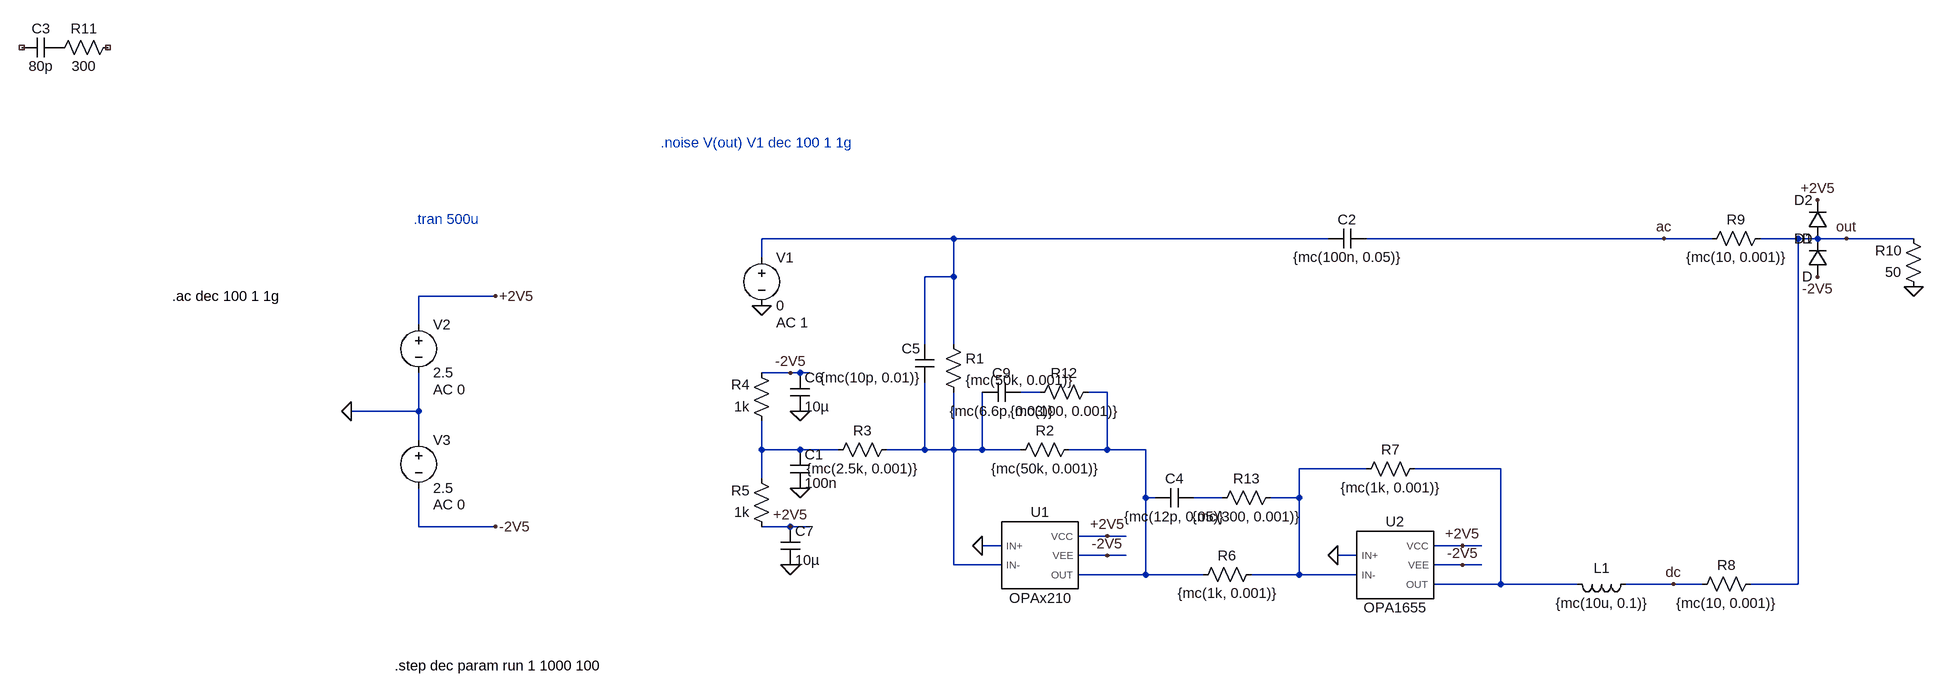
[diagram p0: schematic Draft2.asc]
Draft2.asc, the LTspice schematic file:
Version 4.1
SHEET 1 1824 844
WIRE -304 -48 -624 -48
WIRE 320 -48 -304 -48
WIRE 880 -48 384 -48
WIRE 960 -48 880 -48
WIRE 1104 -48 1040 -48
WIRE 1136 -48 1104 -48
WIRE 1184 -48 1136 -48
WIRE 1296 -48 1184 -48
WIRE -624 -16 -624 -48
WIRE -304 16 -304 -48
WIRE -304 16 -352 16
WIRE -1136 48 -1264 48
WIRE -1264 96 -1264 48
WIRE -352 128 -352 16
WIRE -304 128 -304 16
WIRE -576 176 -624 176
WIRE -560 176 -576 176
WIRE -544 176 -560 176
WIRE -160 208 -192 208
WIRE -48 208 -80 208
WIRE -1264 240 -1264 176
WIRE -1264 240 -1376 240
WIRE -1264 288 -1264 240
WIRE -624 304 -624 256
WIRE -560 304 -624 304
WIRE -496 304 -560 304
WIRE -352 304 -352 192
WIRE -352 304 -416 304
WIRE -304 304 -304 208
WIRE -304 304 -352 304
WIRE -256 304 -256 208
WIRE -256 304 -304 304
WIRE -192 304 -256 304
WIRE -48 304 -48 208
WIRE -48 304 -112 304
WIRE 16 304 -48 304
WIRE 384 336 272 336
WIRE 608 336 464 336
WIRE -624 352 -624 304
WIRE 16 384 16 304
WIRE 32 384 16 384
WIRE 144 384 96 384
WIRE 272 384 272 336
WIRE 272 384 224 384
WIRE -1264 432 -1264 368
WIRE -1136 432 -1264 432
WIRE -576 432 -624 432
WIRE -544 432 -576 432
WIRE -48 448 -96 448
WIRE -16 448 -48 448
WIRE -224 464 -256 464
WIRE 544 464 496 464
WIRE 576 464 544 464
WIRE -48 480 -96 480
WIRE -16 480 -48 480
WIRE 368 480 336 480
WIRE -304 496 -304 304
WIRE -224 496 -304 496
WIRE 544 496 496 496
WIRE 576 496 544 496
WIRE 16 512 16 384
WIRE 16 512 -96 512
WIRE 112 512 16 512
WIRE 272 512 272 384
WIRE 272 512 192 512
WIRE 368 512 272 512
WIRE 608 528 608 336
WIRE 608 528 496 528
WIRE 736 528 608 528
WIRE 896 528 816 528
WIRE 944 528 896 528
WIRE 1104 528 1104 -48
WIRE 1104 528 1024 528
FLAG -624 64 0
FLAG -576 176 -2V5
FLAG -560 368 0
FLAG -576 432 +2V5
FLAG -48 480 -2V5
FLAG -48 448 +2V5
FLAG 336 480 0
FLAG 544 496 -2V5
FLAG 544 464 +2V5
FLAG 1296 32 0
FLAG -1376 240 0
FLAG -1136 48 +2V5
FLAG -1136 432 -2V5
FLAG 1184 -48 out
FLAG 880 -48 ac
FLAG 896 528 dc
FLAG -256 464 0
FLAG 1136 16 -2V5
FLAG 1136 -112 +2V5
FLAG -560 240 0
FLAG -576 496 0
SYMBOL res -320 112 R0
SYMATTR InstName R1
SYMATTR Value {mc(50k, 0.001)}
SYMBOL res -96 288 R90
WINDOW 0 0 56 VBottom 2
WINDOW 3 32 56 VTop 2
SYMATTR InstName R2
SYMATTR Value {mc(50k, 0.001)}
SYMBOL res -400 288 R90
WINDOW 0 0 56 VBottom 2
WINDOW 3 32 56 VTop 2
SYMATTR InstName R3
SYMATTR Value {mc(2.5k, 0.001)}
SYMBOL res -608 272 R180
WINDOW 0 36 76 Left 2
WINDOW 3 36 40 Left 2
SYMATTR InstName R4
SYMATTR Value 1k
SYMBOL res -608 448 R180
WINDOW 0 36 76 Left 2
WINDOW 3 36 40 Left 2
SYMATTR InstName R5
SYMATTR Value 1k
SYMBOL voltage -624 -32 R0
WINDOW 123 24 124 Left 2
WINDOW 39 0 0 Left 0
SYMATTR InstName V1
SYMATTR Value 0
SYMATTR Value2 AC 1
SYMBOL cap -576 304 R0
SYMATTR InstName C1
SYMATTR Value 100n
SYMBOL cap 384 -64 R90
WINDOW 0 0 32 VBottom 2
WINDOW 3 32 32 VTop 2
SYMATTR InstName C2
SYMATTR Value {mc(100n, 0.05)}
SYMATTR SpiceLine Rser=10m Lser=2n
SYMBOL OPAx210 -160 480 R0
SYMATTR InstName U1
SYMBOL res 208 496 R90
WINDOW 0 0 56 VBottom 2
WINDOW 3 32 56 VTop 2
SYMATTR InstName R6
SYMATTR Value {mc(1k, 0.001)}
SYMBOL res 480 320 R90
WINDOW 0 0 56 VBottom 2
WINDOW 3 32 56 VTop 2
SYMATTR InstName R7
SYMATTR Value {mc(1k, 0.001)}
SYMBOL OPA1655 432 496 R0
SYMATTR InstName U2
SYMBOL ind 832 512 R90
WINDOW 0 5 56 VBottom 2
WINDOW 3 32 56 VTop 2
SYMATTR InstName L1
SYMATTR Value {mc(10u, 0.1)}
SYMATTR SpiceLine Ipk=0.74 Rser=0.056 Rpar=0 Cpar=0
SYMBOL res 1040 512 R90
WINDOW 0 0 56 VBottom 2
WINDOW 3 32 56 VTop 2
SYMATTR InstName R8
SYMATTR Value {mc(10, 0.001)}
SYMBOL res 1056 -64 R90
WINDOW 0 0 56 VBottom 2
WINDOW 3 32 56 VTop 2
SYMATTR InstName R9
SYMATTR Value {mc(10, 0.001)}
SYMBOL res 1312 48 R180
WINDOW 0 36 76 Left 2
WINDOW 3 36 40 Left 2
SYMATTR InstName R10
SYMATTR Value 50
SYMBOL voltage -1264 80 R0
WINDOW 123 24 124 Left 2
WINDOW 39 0 0 Left 0
SYMATTR InstName V2
SYMATTR Value 2.5
SYMATTR Value2 AC 0
SYMBOL voltage -1264 272 R0
WINDOW 123 24 124 Left 2
WINDOW 39 0 0 Left 0
SYMATTR InstName V3
SYMATTR Value 2.5
SYMATTR Value2 AC 0
SYMBOL cap -9920 -1184 R90
WINDOW 0 0 32 VBottom 2
WINDOW 3 32 32 VTop 2
SYMATTR InstName C3
SYMATTR Value 80p
SYMBOL res -9824 -1184 R90
WINDOW 0 0 56 VBottom 2
WINDOW 3 32 56 VTop 2
SYMATTR InstName R11
SYMATTR Value 300
SYMBOL diode 1152 16 R180
WINDOW 0 24 64 Left 2
WINDOW 3 24 0 Left 2
SYMATTR InstName D1
SYMBOL diode 1152 -48 R180
WINDOW 0 24 64 Left 2
WINDOW 3 24 0 Left 2
SYMATTR InstName D2
SYMBOL cap -576 176 R0
SYMATTR InstName C6
SYMATTR Value 10µ
SYMBOL cap -592 432 R0
SYMATTR InstName C7
SYMATTR Value 10µ
SYMBOL cap 96 368 R90
WINDOW 0 0 32 VBottom 2
WINDOW 3 32 32 VTop 2
SYMATTR InstName C4
SYMATTR Value {mc(12p, 0.05)}
SYMATTR SpiceLine V=200 Irms=957.257m Rser=0.163695 Lser=409.656p
SYMBOL cap -336 192 R180
WINDOW 0 24 56 Left 2
WINDOW 3 24 8 Left 2
SYMATTR InstName C5
SYMATTR Value {mc(10p, 0.01)}
SYMATTR SpiceLine V=50 Irms=0 Rser=0.5317 Lser=450p
SYMBOL cap -256 224 R270
WINDOW 0 32 32 VTop 2
WINDOW 3 0 32 VBottom 2
SYMATTR InstName C9
SYMATTR Value {mc(6.6p, 0.03)}
SYMATTR SpiceLine V=1.5K Irms=813.688m Rser=0.728 Lser=862.574p
SYMBOL res 240 368 R90
WINDOW 0 0 56 VBottom 2
WINDOW 3 32 56 VTop 2
SYMATTR InstName R13
SYMATTR Value {mc(300, 0.001)}
SYMATTR SpiceLine tol=1 pwr=0.1
SYMBOL res -64 192 R90
WINDOW 0 0 56 VBottom 2
WINDOW 3 32 56 VTop 2
SYMATTR InstName R12
SYMATTR Value {mc(100, 0.001)}
TEXT -1776 48 Left 2 !.ac dec 100 1 1g
TEXT -1272 -80 Left 2 ;.tran 500u
TEXT -1304 664 Left 2 !.step dec param run 1 1000 100
TEXT -792 -208 Left 2 ;.noise V(out) V1 dec 100 1 1g

The netlist it stands for:
* Draft2.asc
R1 N001 N005 {mc(50k, 0.001)}
R2 N003 N005 {mc(50k, 0.001)}
R3 N005 N004 {mc(2.5k, 0.001)}
R4 N004 -2V5 1k
R5 +2V5 N004 1k
V1 N001 0 0 AC 1
C1 N004 0 100n
C2 ac N001 {mc(100n, 0.05)} Rser=10m Lser=2n
X§U1 0 N005 +2V5 -2V5 N003 OPAx210  ; pins IN+ IN- VCC VEE OUT
R6 N006 N003 {mc(1k, 0.001)}
R7 N007 N006 {mc(1k, 0.001)}
X§U2 0 N006 +2V5 -2V5 N007 OPA1655  ; pins IN+ IN- VCC VEE OUT
L1 dc N007 {mc(10u, 0.1)} Ipk=0.74 Rser=0.056 Rpar=0 Cpar=0
R8 out dc {mc(10, 0.001)}
R9 out ac {mc(10, 0.001)}
R10 0 out 50
V2 +2V5 0 2.5 AC 0
V3 0 -2V5 2.5 AC 0
C3 P001 NC_01 80p
R11 NC_02 P001 300
D1 -2V5 out D
D2 out +2V5 D
C6 -2V5 0 10µ
C7 +2V5 0 10µ
C4 N008 N003 {mc(12p, 0.05)} V=200 Irms=957.257m Rser=0.163695 Lser=409.656p
C5 N005 N001 {mc(10p, 0.01)} V=50 Irms=0 Rser=0.5317 Lser=450p
C9 N005 N002 {mc(6.6p, 0.03)} V=1.5K Irms=813.688m Rser=0.728 Lser=862.574p
R13 N006 N008 {mc(300, 0.001)} tol=1 pwr=0.1
R12 N003 N002 {mc(100, 0.001)}
.model D D
.lib standard.dio
.ac dec 100 1 1g
* .tran 500u
.step dec param run 1 1000 100
* .noise V(out) V1 dec 100 1 1g
.lib OPAx210.LIB
.lib OPA1655.LIB
.backanno
.end